# Altium schematic sheet IPO2_7Seg_V0.011.SchDoc
size 594 x 420 mm
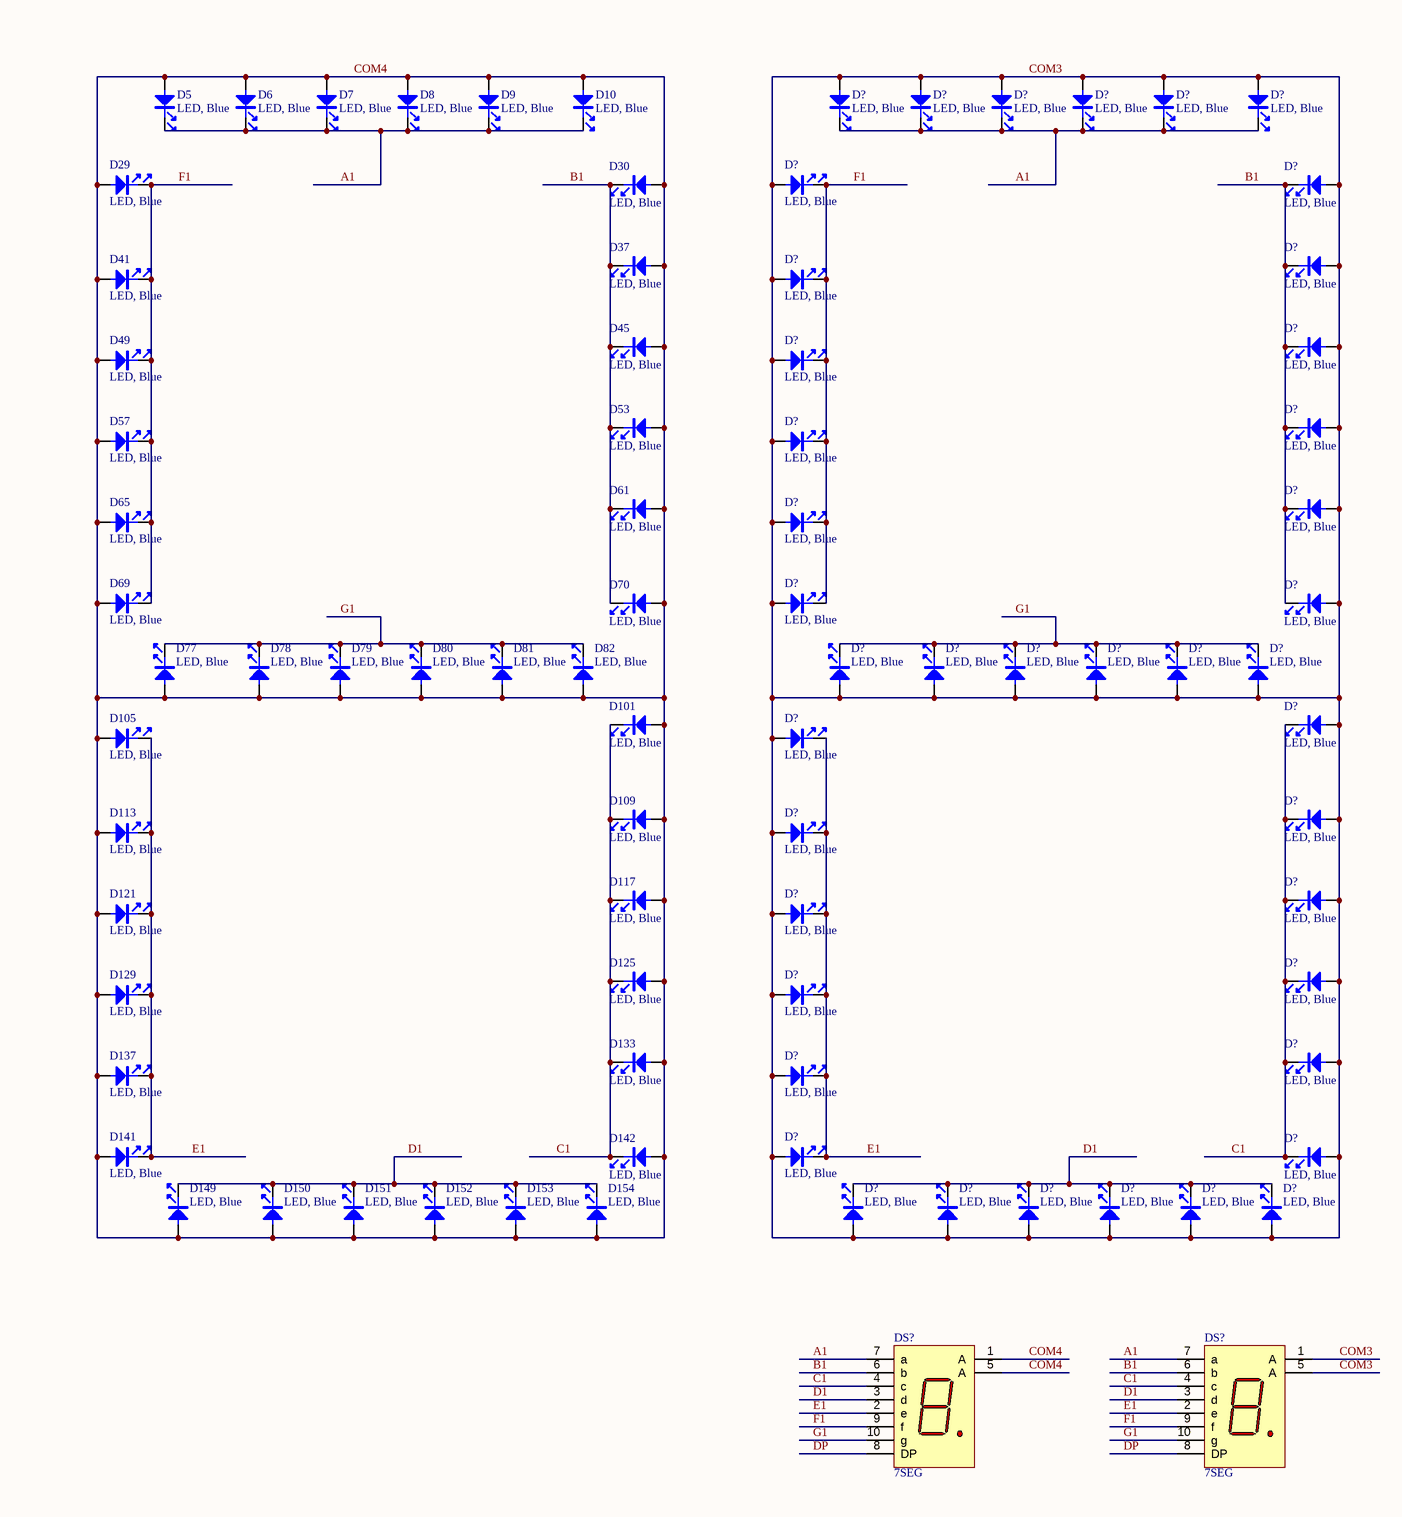
[diagram p0: IPO2_7Seg_V0.011.SchDoc, left]
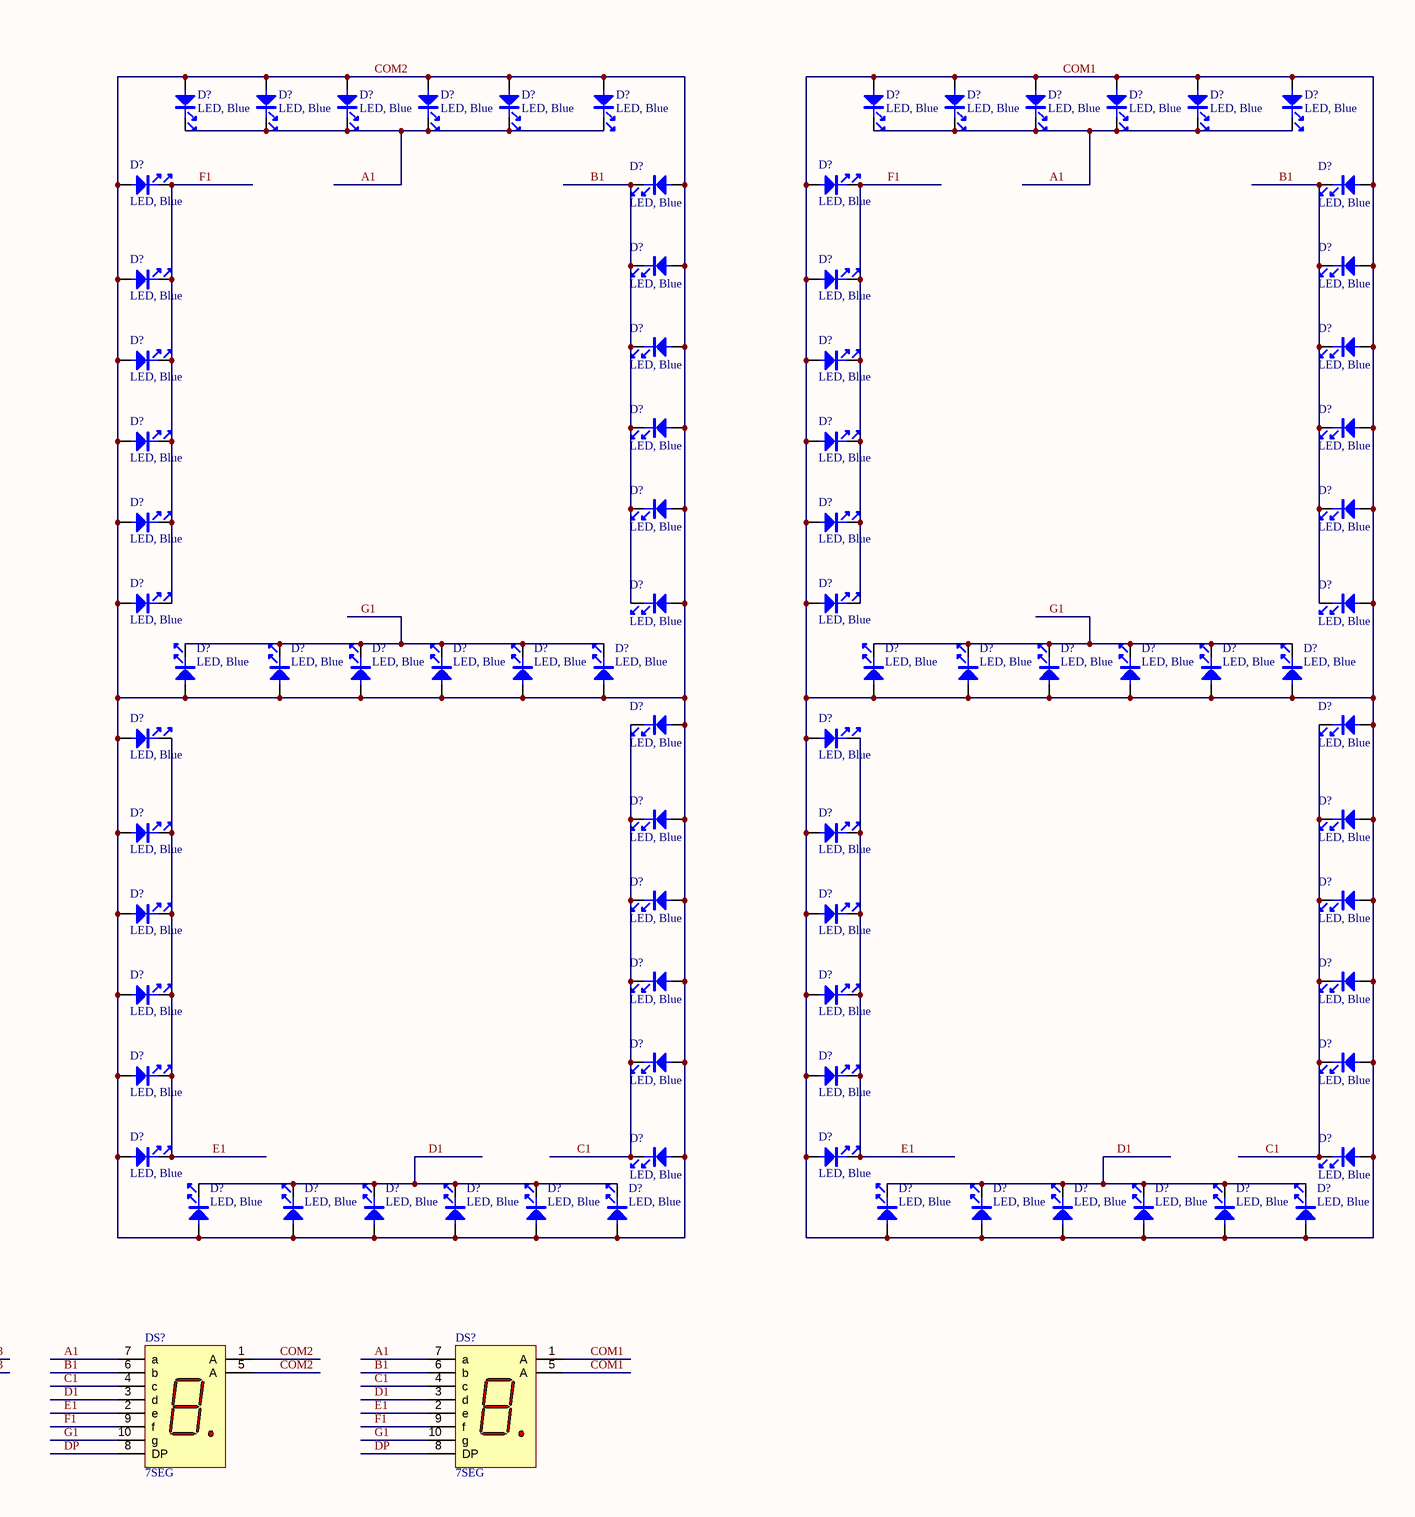
[diagram p1: IPO2_7Seg_V0.011.SchDoc, right]

## Parts
(Parts that share a designator on the sheet are numbered #1, #2 ... from top to bottom, then left to right.)
D5  LED, Blue  [LED-0805-BLUE]
D6  LED, Blue  [LED-0805-BLUE]
D7  LED, Blue  [LED-0805-BLUE]
D8  LED, Blue  [LED-0805-BLUE]
D9  LED, Blue  [LED-0805-BLUE]
D10  LED, Blue  [LED-0805-BLUE]
D29  LED, Blue  [LED-0805-BLUE]
D30  LED, Blue  [LED-0805-BLUE]
D37  LED, Blue  [LED-0805-BLUE]
D41  LED, Blue  [LED-0805-BLUE]
D45  LED, Blue  [LED-0805-BLUE]
D49  LED, Blue  [LED-0805-BLUE]
D53  LED, Blue  [LED-0805-BLUE]
D57  LED, Blue  [LED-0805-BLUE]
D61  LED, Blue  [LED-0805-BLUE]
D65  LED, Blue  [LED-0805-BLUE]
D69  LED, Blue  [LED-0805-BLUE]
D70  LED, Blue  [LED-0805-BLUE]
D77  LED, Blue  [LED-0805-BLUE]
D78  LED, Blue  [LED-0805-BLUE]
D79  LED, Blue  [LED-0805-BLUE]
D80  LED, Blue  [LED-0805-BLUE]
D81  LED, Blue  [LED-0805-BLUE]
D82  LED, Blue  [LED-0805-BLUE]
D101  LED, Blue  [LED-0805-BLUE]
D105  LED, Blue  [LED-0805-BLUE]
D109  LED, Blue  [LED-0805-BLUE]
D113  LED, Blue  [LED-0805-BLUE]
D117  LED, Blue  [LED-0805-BLUE]
D121  LED, Blue  [LED-0805-BLUE]
D125  LED, Blue  [LED-0805-BLUE]
D129  LED, Blue  [LED-0805-BLUE]
D133  LED, Blue  [LED-0805-BLUE]
D137  LED, Blue  [LED-0805-BLUE]
D141  LED, Blue  [LED-0805-BLUE]
D142  LED, Blue  [LED-0805-BLUE]
D149  LED, Blue  [LED-0805-BLUE]
D150  LED, Blue  [LED-0805-BLUE]
D151  LED, Blue  [LED-0805-BLUE]
D152  LED, Blue  [LED-0805-BLUE]
D153  LED, Blue  [LED-0805-BLUE]
D154  LED, Blue  [LED-0805-BLUE]
D?#1  LED, Blue  [LED-0805-BLUE]
D?#2  LED, Blue  [LED-0805-BLUE]
D?#3  LED, Blue  [LED-0805-BLUE]
D?#4  LED, Blue  [LED-0805-BLUE]
D?#5  LED, Blue  [LED-0805-BLUE]
D?#6  LED, Blue  [LED-0805-BLUE]
D?#7  LED, Blue  [LED-0805-BLUE]
D?#8  LED, Blue  [LED-0805-BLUE]
D?#9  LED, Blue  [LED-0805-BLUE]
D?#10  LED, Blue  [LED-0805-BLUE]
D?#11  LED, Blue  [LED-0805-BLUE]
D?#12  LED, Blue  [LED-0805-BLUE]
D?#13  LED, Blue  [LED-0805-BLUE]
D?#14  LED, Blue  [LED-0805-BLUE]
D?#15  LED, Blue  [LED-0805-BLUE]
D?#16  LED, Blue  [LED-0805-BLUE]
D?#17  LED, Blue  [LED-0805-BLUE]
D?#18  LED, Blue  [LED-0805-BLUE]
D?#19  LED, Blue  [LED-0805-BLUE]
D?#20  LED, Blue  [LED-0805-BLUE]
D?#21  LED, Blue  [LED-0805-BLUE]
D?#22  LED, Blue  [LED-0805-BLUE]
D?#23  LED, Blue  [LED-0805-BLUE]
D?#24  LED, Blue  [LED-0805-BLUE]
D?#25  LED, Blue  [LED-0805-BLUE]
D?#26  LED, Blue  [LED-0805-BLUE]
D?#27  LED, Blue  [LED-0805-BLUE]
D?#28  LED, Blue  [LED-0805-BLUE]
D?#29  LED, Blue  [LED-0805-BLUE]
D?#30  LED, Blue  [LED-0805-BLUE]
D?#31  LED, Blue  [LED-0805-BLUE]
D?#32  LED, Blue  [LED-0805-BLUE]
D?#33  LED, Blue  [LED-0805-BLUE]
D?#34  LED, Blue  [LED-0805-BLUE]
D?#35  LED, Blue  [LED-0805-BLUE]
D?#36  LED, Blue  [LED-0805-BLUE]
D?#37  LED, Blue  [LED-0805-BLUE]
D?#38  LED, Blue  [LED-0805-BLUE]
D?#39  LED, Blue  [LED-0805-BLUE]
D?#40  LED, Blue  [LED-0805-BLUE]
D?#41  LED, Blue  [LED-0805-BLUE]
D?#42  LED, Blue  [LED-0805-BLUE]
D?#43  LED, Blue  [LED-0805-BLUE]
D?#44  LED, Blue  [LED-0805-BLUE]
D?#45  LED, Blue  [LED-0805-BLUE]
D?#46  LED, Blue  [LED-0805-BLUE]
D?#47  LED, Blue  [LED-0805-BLUE]
D?#48  LED, Blue  [LED-0805-BLUE]
D?#49  LED, Blue  [LED-0805-BLUE]
D?#50  LED, Blue  [LED-0805-BLUE]
D?#51  LED, Blue  [LED-0805-BLUE]
D?#52  LED, Blue  [LED-0805-BLUE]
D?#53  LED, Blue  [LED-0805-BLUE]
D?#54  LED, Blue  [LED-0805-BLUE]
D?#55  LED, Blue  [LED-0805-BLUE]
D?#56  LED, Blue  [LED-0805-BLUE]
D?#57  LED, Blue  [LED-0805-BLUE]
D?#58  LED, Blue  [LED-0805-BLUE]
D?#59  LED, Blue  [LED-0805-BLUE]
D?#60  LED, Blue  [LED-0805-BLUE]
D?#61  LED, Blue  [LED-0805-BLUE]
D?#62  LED, Blue  [LED-0805-BLUE]
D?#63  LED, Blue  [LED-0805-BLUE]
D?#64  LED, Blue  [LED-0805-BLUE]
D?#65  LED, Blue  [LED-0805-BLUE]
D?#66  LED, Blue  [LED-0805-BLUE]
D?#67  LED, Blue  [LED-0805-BLUE]
D?#68  LED, Blue  [LED-0805-BLUE]
D?#69  LED, Blue  [LED-0805-BLUE]
D?#70  LED, Blue  [LED-0805-BLUE]
D?#71  LED, Blue  [LED-0805-BLUE]
D?#72  LED, Blue  [LED-0805-BLUE]
D?#73  LED, Blue  [LED-0805-BLUE]
D?#74  LED, Blue  [LED-0805-BLUE]
D?#75  LED, Blue  [LED-0805-BLUE]
D?#76  LED, Blue  [LED-0805-BLUE]
D?#77  LED, Blue  [LED-0805-BLUE]
D?#78  LED, Blue  [LED-0805-BLUE]
D?#79  LED, Blue  [LED-0805-BLUE]
D?#80  LED, Blue  [LED-0805-BLUE]
D?#81  LED, Blue  [LED-0805-BLUE]
D?#82  LED, Blue  [LED-0805-BLUE]
D?#83  LED, Blue  [LED-0805-BLUE]
D?#84  LED, Blue  [LED-0805-BLUE]
D?#85  LED, Blue  [LED-0805-BLUE]
D?#86  LED, Blue  [LED-0805-BLUE]
D?#87  LED, Blue  [LED-0805-BLUE]
D?#88  LED, Blue  [LED-0805-BLUE]
D?#89  LED, Blue  [LED-0805-BLUE]
D?#90  LED, Blue  [LED-0805-BLUE]
D?#91  LED, Blue  [LED-0805-BLUE]
D?#92  LED, Blue  [LED-0805-BLUE]
D?#93  LED, Blue  [LED-0805-BLUE]
D?#94  LED, Blue  [LED-0805-BLUE]
D?#95  LED, Blue  [LED-0805-BLUE]
D?#96  LED, Blue  [LED-0805-BLUE]
D?#97  LED, Blue  [LED-0805-BLUE]
D?#98  LED, Blue  [LED-0805-BLUE]
D?#99  LED, Blue  [LED-0805-BLUE]
D?#100  LED, Blue  [LED-0805-BLUE]
D?#101  LED, Blue  [LED-0805-BLUE]
D?#102  LED, Blue  [LED-0805-BLUE]
D?#103  LED, Blue  [LED-0805-BLUE]
D?#104  LED, Blue  [LED-0805-BLUE]
D?#105  LED, Blue  [LED-0805-BLUE]
D?#106  LED, Blue  [LED-0805-BLUE]
D?#107  LED, Blue  [LED-0805-BLUE]
D?#108  LED, Blue  [LED-0805-BLUE]
D?#109  LED, Blue  [LED-0805-BLUE]
D?#110  LED, Blue  [LED-0805-BLUE]
D?#111  LED, Blue  [LED-0805-BLUE]
D?#112  LED, Blue  [LED-0805-BLUE]
D?#113  LED, Blue  [LED-0805-BLUE]
D?#114  LED, Blue  [LED-0805-BLUE]
D?#115  LED, Blue  [LED-0805-BLUE]
D?#116  LED, Blue  [LED-0805-BLUE]
D?#117  LED, Blue  [LED-0805-BLUE]
D?#118  LED, Blue  [LED-0805-BLUE]
D?#119  LED, Blue  [LED-0805-BLUE]
D?#120  LED, Blue  [LED-0805-BLUE]
D?#121  LED, Blue  [LED-0805-BLUE]
D?#122  LED, Blue  [LED-0805-BLUE]
D?#123  LED, Blue  [LED-0805-BLUE]
D?#124  LED, Blue  [LED-0805-BLUE]
D?#125  LED, Blue  [LED-0805-BLUE]
D?#126  LED, Blue  [LED-0805-BLUE]
DS?#1  7SEG  [7Seg 90*60]
DS?#2  7SEG  [7Seg 90*60]
DS?#3  7SEG  [7Seg 90*60]
DS?#4  7SEG  [7Seg 90*60]

## Nets
A1: D5.1 D6.1 D7.1 D8.1 D9.1 D10.1 D?#1.1 D?#2.1 D?#3.1 D?#4.1 D?#5.1 D?#6.1 D?#7.1 D?#8.1 D?#9.1 D?#10.1 D?#11.1 D?#12.1 D?#13.1 D?#14.1 D?#15.1 D?#16.1 D?#17.1 D?#18.1 DS?#1.7(a) DS?#2.7(a) DS?#3.7(a) DS?#4.7(a)
B1: D30.1 D37.1 D45.1 D53.1 D61.1 D70.1 D?#20.1 D?#22.1 D?#24.1 D?#25.1 D?#26.1 D?#27.1 D?#31.1 D?#32.1 D?#33.1 D?#37.1 D?#38.1 D?#39.1 D?#43.1 D?#44.1 D?#45.1 D?#50.1 D?#52.1 D?#54.1 DS?#1.6(b) DS?#2.6(b) DS?#3.6(b) DS?#4.6(b)
C1: D101.1 D109.1 D117.1 D125.1 D133.1 D142.1 D?#73.1 D?#74.1 D?#75.1 D?#79.1 D?#80.1 D?#81.1 D?#85.1 D?#86.1 D?#87.1 D?#91.1 D?#92.1 D?#93.1 D?#97.1 D?#98.1 D?#99.1 D?#104.1 D?#106.1 D?#108.1 DS?#1.4(c) DS?#2.4(c) DS?#3.4(c) DS?#4.4(c)
COM1: D?#13.2 D?#14.2 D?#15.2 D?#16.2 D?#17.2 D?#18.2 D?#23.2 D?#24.2 D?#27.2 D?#30.2 D?#33.2 D?#36.2 D?#39.2 D?#42.2 D?#45.2 D?#48.2 D?#53.2 D?#54.2 D?#67.2 D?#68.2 D?#69.2 D?#70.2 D?#71.2 D?#72.2 D?#75.2 D?#78.2 D?#81.2 D?#84.2 D?#87.2 D?#90.2 D?#93.2 D?#96.2 D?#99.2 D?#102.2 D?#107.2 D?#108.2 D?#121.2 D?#122.2 D?#123.2 D?#124.2 D?#125.2 D?#126.2 DS?#4.1(A) DS?#4.5(A)
COM2: D?#7.2 D?#8.2 D?#9.2 D?#10.2 D?#11.2 D?#12.2 D?#21.2 D?#22.2 D?#26.2 D?#29.2 D?#32.2 D?#35.2 D?#38.2 D?#41.2 D?#44.2 D?#47.2 D?#51.2 D?#52.2 D?#61.2 D?#62.2 D?#63.2 D?#64.2 D?#65.2 D?#66.2 D?#74.2 D?#77.2 D?#80.2 D?#83.2 D?#86.2 D?#89.2 D?#92.2 D?#95.2 D?#98.2 D?#101.2 D?#105.2 D?#106.2 D?#115.2 D?#116.2 D?#117.2 D?#118.2 D?#119.2 D?#120.2 DS?#3.1(A) DS?#3.5(A)
COM3: D?#1.2 D?#2.2 D?#3.2 D?#4.2 D?#5.2 D?#6.2 D?#19.2 D?#20.2 D?#25.2 D?#28.2 D?#31.2 D?#34.2 D?#37.2 D?#40.2 D?#43.2 D?#46.2 D?#49.2 D?#50.2 D?#55.2 D?#56.2 D?#57.2 D?#58.2 D?#59.2 D?#60.2 D?#73.2 D?#76.2 D?#79.2 D?#82.2 D?#85.2 D?#88.2 D?#91.2 D?#94.2 D?#97.2 D?#100.2 D?#103.2 D?#104.2 D?#109.2 D?#110.2 D?#111.2 D?#112.2 D?#113.2 D?#114.2 DS?#2.1(A) DS?#2.5(A)
COM4: D5.2 D6.2 D7.2 D8.2 D9.2 D10.2 D29.2 D30.2 D37.2 D41.2 D45.2 D49.2 D53.2 D57.2 D61.2 D65.2 D69.2 D70.2 D77.2 D78.2 D79.2 D80.2 D81.2 D82.2 D101.2 D105.2 D109.2 D113.2 D117.2 D121.2 D125.2 D129.2 D133.2 D137.2 D141.2 D142.2 D149.2 D150.2 D151.2 D152.2 D153.2 D154.2 DS?#1.1(A) DS?#1.5(A)
D1: D149.1 D150.1 D151.1 D152.1 D153.1 D154.1 D?#109.1 D?#110.1 D?#111.1 D?#112.1 D?#113.1 D?#114.1 D?#115.1 D?#116.1 D?#117.1 D?#118.1 D?#119.1 D?#120.1 D?#121.1 D?#122.1 D?#123.1 D?#124.1 D?#125.1 D?#126.1 DS?#1.3(d) DS?#2.3(d) DS?#3.3(d) DS?#4.3(d)
DP: DS?#1.8(DP) DS?#2.8(DP) DS?#3.8(DP) DS?#4.8(DP)
E1: D105.1 D113.1 D121.1 D129.1 D137.1 D141.1 D?#76.1 D?#77.1 D?#78.1 D?#82.1 D?#83.1 D?#84.1 D?#88.1 D?#89.1 D?#90.1 D?#94.1 D?#95.1 D?#96.1 D?#100.1 D?#101.1 D?#102.1 D?#103.1 D?#105.1 D?#107.1 DS?#1.2(e) DS?#2.2(e) DS?#3.2(e) DS?#4.2(e)
F1: D29.1 D41.1 D49.1 D57.1 D65.1 D69.1 D?#19.1 D?#21.1 D?#23.1 D?#28.1 D?#29.1 D?#30.1 D?#34.1 D?#35.1 D?#36.1 D?#40.1 D?#41.1 D?#42.1 D?#46.1 D?#47.1 D?#48.1 D?#49.1 D?#51.1 D?#53.1 DS?#1.9(f) DS?#2.9(f) DS?#3.9(f) DS?#4.9(f)
G1: D77.1 D78.1 D79.1 D80.1 D81.1 D82.1 D?#55.1 D?#56.1 D?#57.1 D?#58.1 D?#59.1 D?#60.1 D?#61.1 D?#62.1 D?#63.1 D?#64.1 D?#65.1 D?#66.1 D?#67.1 D?#68.1 D?#69.1 D?#70.1 D?#71.1 D?#72.1 DS?#1.10(g) DS?#2.10(g) DS?#3.10(g) DS?#4.10(g)

## Notes on the sheet
- DWG NO:
- REV:
- THIS DOCUMENT AND THE DATA DISCLOSED HEREIN OR
- HEREWITH IS THE PROPERTY OF ALTIUM LIMITED AND MAY
- BE FREELY DISTRIBUTED IN WHOLE. NO RIGHTS ARE
- RESERVED OR EXPRESS OR IMPLIED WARANTEE GIVEN.
- REVISION
- DESCRIPTION
- DATE
- APPROVED
- ENG:
- APPROVALS
- PROJECT
- DSN:
- CHK:
- REFERENCE DOCUMENTS
- PROJECT REVISION:
- TITLE
- DOCUMENT REVISION:
- DESIGN ITEM:
- BOM:
- FAB DWG:
- PCB DWG:
- ASSY DWG:
- SCALE:
- A2
- SIZE
- CAGE CODE
- FILE NAME
- DWG NO.
- SHEET
- OF
- REV

## Library data of the parts
D5-D10 D29 D30 D37 D41 D45 D49 D53 D57 D61 D65 D69 D70 D77-D82 D101 D105 D109 D113 D117 D121 D125 D129 D133 D137 D141 D142 D149-D154 D?#1-D?#126 = LED_blue 0805: LED, Blue, 0805; Manuf_1: everlight; Manuf_Part_1: 19-213-R6C-AP1Q2B/3T; ECCN_US/EU: EAR99/NEC; Order: 19-213-R6C-AP1Q2B/3T
DS?#1-DS?#4 = 7SEG 90*60mm: 7-Segment Display 90*60mm; LED_Colour: As AlInGaP Red; Published: 26-May-2004; LatestRevisionDate: 11-Oct-2004; LatestRevisionNote: Display outline superimposed on PCB Footprint.; DatasheetDocument: 20-Nov-2001; PackageDocument: 01-Oct-2001; PackageReference: Case-5; Publisher: Altium Limited; ComponentLink1Description: Manufacturer Link; ComponentLink1URL: http://www.agilent.com/; ComponentLink2Description: Datasheet; ComponentLink2URL: http://cp.literature.agilent.com/litweb/pdf/5988-4823EN.pdf